# Altium schematic sheet Schematic.SchDoc
size A
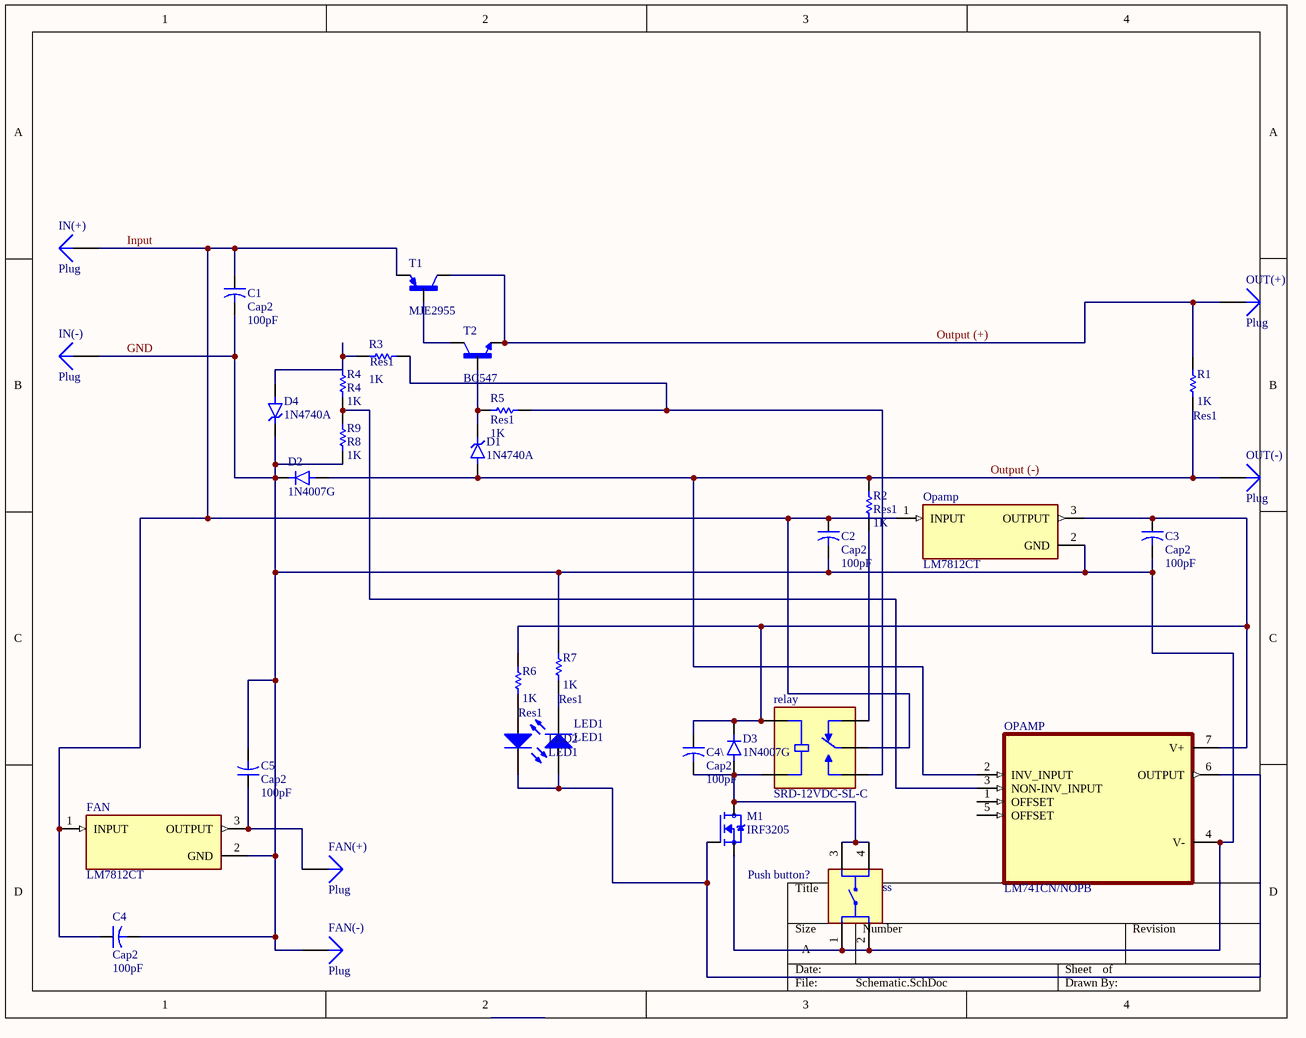
[diagram p0: Schematic.SchDoc]

## Parts
(Parts that share a designator on the sheet are numbered #1, #2 ... from top to bottom, then left to right.)
C1  Cap2  value 100pF  [CAPR5-4X5]
C2  Cap2  value 100pF  [CAPR5-4X5]
C3  Cap2  value 100pF  [CAPR5-4X5]
C4  Cap2  value 100pF  [CAPR5-4X5]
C4\  Cap2  value 100pF  [CAPR5-4X5]
C5  Cap2  value 100pF  [CAPR5-4X5]
D1  1N4740A  [DIOAD1060W70L435D230]
D2  1N4007G  [DIOAD1036W78L470D235]
D3  1N4007G  [DIOAD1036W78L470D235]
D4  1N4740A  [DIOAD1060W70L435D230]
FAN  LM7812CT  [TO253P1057X470X2040-3]
FAN(+)  Plug  [PIN1]
FAN(-)  Plug  [PIN1]
IN(+)  Plug  [PIN1]
IN(-)  Plug  [PIN1]
LED1  LED1  [LED-1]
LED2  LED1  [LED-1]
M1  IRF3205  [TO254P1041X444X2933-3]
Opamp#1  LM7812CT  [TO253P1057X470X2040-3]
OPAMP#2  LM741CN/NOPB  [DIP794W45P254L959H508Q8]
OUT(+)  Plug  [PIN1]
OUT(-)  Plug  [PIN1]
Push_button?  ss  [TE_1825910-2]
R1  Res1  value 1K  [AXIAL-0.3]
R2  Res1  value 1K  [AXIAL-0.3]
R3  Res1  value 1K  [AXIAL-0.3]
R4  R4  value 1K  [AXIAL-0.3]
R5  Res1  value 1K  [AXIAL-0.3]
R6  Res1  value 1K  [AXIAL-0.3]
R7  Res1  value 1K  [AXIAL-0.3]
R9  R8  value 1K  [AXIAL-0.3]
relay  SRD-12VDC-SL-C  [RELAY_SRD-12VDC-SL-C]
T1  MJE2955  [TO254P1010X470X2933-3]
T2  BC547  [TO92]

## Nets
GND: C1.2 C2.2 C3.2 C4.2 C5.2 D2.C(K) D4.C(K) FAN.2(GND) FAN(-).1 IN(-).1 M1.3(S) Opamp#1.2(GND) OPAMP#2.4(V-) Push_button?.1 Push_button?.2 R7.2 R9.2
Input: C1.1 C2.1 C4.1 FAN.1(INPUT) IN(+).1 Opamp#1.1(INPUT) relay.COM T1.3(E)
Output (+): OUT(+).1 R1.2 T1.2(C) T2.1(E)
Output (-): D1.A D2.A OPAMP#2.2(INV_INPUT) OUT(-).1 R1.1 R2.2
NetC3_1: C3.1 C4\.1 D3.C(K) Opamp#1.3(OUTPUT) OPAMP#2.7(V+) R6.2 relay.COIL1
NetC~{4}_2: C4\.2 D3.A M1.2(D) Push_button?.3 Push_button?.4 relay.COIL2
NetC5_1: C5.1 FAN.3(OUTPUT) FAN(+).1
NetD1_C: D1.C(K) R5.2 T2.2(B)
NetD4_A: D4.A R3.2 R4.1
NetLED1_1: LED1.1(A) LED2.2(K) M1.1(G) OPAMP#2.6(OUTPUT)
NetLED1_2: LED1.2(K) R7.1
NetLED2_1: LED2.1(A) R6.1
NetOPAMP#2_3: OPAMP#2.3(NON-INV_INPUT) R4.2 R9.1
NetR2_1: R2.1 relay.NC
NetR3_1: R3.1 R5.1 relay.NO
NetT1_1: T1.1(B) T2.3(C)

Not connected (* = marked no-connect by the designer): OPAMP#2 1(OFFSET) 5(OFFSET)

## Library data of the parts
C1-C4 C4\ C5 = Cap2: Capacitor; Published: 23-Sep-2002; PackageReference: CAPR5-4X5; Publisher: Altium Limited; PackageDescription: Capacitor; 2 Leads
D1 D4 = 1N4740A: DO-204AL (DO-41), 1000mW, 5%, Zener Diode; MF: Taiwan Semiconductor; Check_prices: https://www.snapeda.com/parts/1N4740A/Taiwan+Semiconductor/view-part/?ref=eda; Value: *; Availability: In Stock; MP: 1N4740A; Price: None; Package: DO-41 Taiwan Semiconductor; SnapEDA_Link: https://www.snapeda.com/parts/1N4740A/Taiwan+Semiconductor/view-part/?ref=snap
D2 D3 = 1N4007G: 1A, 1000V, Standard Recovery Rectifier; MF: Taiwan Semiconductor; Check_prices: https://www.snapeda.com/parts/1N4007G/Taiwan+Semiconductor/view-part/?ref=eda; Value: *; Availability: In Stock; MP: 1N4007G; Price: None; Package: DO-41 Taiwan Semiconductor; SnapEDA_Link: https://www.snapeda.com/parts/1N4007G/Taiwan+Semiconductor/view-part/?ref=snap; Purchase-URL: https://pricing.snapeda.com/search/part/1N4007G/?ref=eda
FAN Opamp#1 = LM7812CT: Linear Voltage Regulator IC Positive Fixed 1 Output  1A TO-220-3; MF: ON Semiconductor; Package: TO-220; MP: LM7812CT; Check_prices: https://www.snapeda.com/parts/LM7812CT/Onsemi/view-part/?ref=eda; Value: *; Price: None; Availability: Unavailable; SnapEDA_Link: https://www.snapeda.com/parts/LM7812CT/Onsemi/view-part/?ref=snap
LED1 LED2 = LED1: Typical RED GaAs LED; Published: 8-Jun-2000; LatestRevisionDate: 08-Jul-2005; LatestRevisionNote: Mech Layer 1 removed.; PackageReference: LED-1; Publisher: Altium Limited; PackageDescription: LED; 2 Leads
M1 = IRF3205: N-Channel 55V 110A (Tc) 200W (Tc) Through Hole TO-220AB; MF: Infineon Technologies; Price: None; Value: *; Purchase-URL: https://pricing.snapeda.com/search/part/IRF3205/?ref=eda; Package: TO-220 Infineon; Availability: In Stock; MP: IRF3205; SnapEDA_Link: https://www.snapeda.com/parts/IRF3205/Infineon+Technologies/view-part/?ref=snap; Check_prices: https://www.snapeda.com/parts/IRF3205/Infineon+Technologies/view-part/?ref=eda
OPAMP#2 = LM741CN/NOPB: Single 44V 1MHz operational amplifier 8-PDIP 0 to 70; MF: Texas Instruments; SnapEDA_Link: https://www.snapeda.com/parts/LM741CN/NOPB/Texas%20Instruments/view-part/74633/?ref=snap; Availability: Unavailable; MP: LM741CN/NOPB; DigiKey-Purchase-URL: https://snapeda.com/shop?store=DigiKey&id=74633; Price: None; Value: *; Texas_Instruments-Purchase-URL: https://snapeda.com/shop?store=Texas+Instruments&id=74633; Mouser-Purchase-URL: https://snapeda.com/shop?store=Mouser&id=74633; Package: PDIP-8 Texas Instruments
Push_button? = 1825910-2: 50 mA SPST Round Actuator 160 Gram Force Tactile Pushbutton Switch; MF: TE Connectivity; Check_prices: https://www.snapeda.com/parts/1825910-2/TE+Connectivity+ALCOSWITCH+Switches/view-part/?ref=eda; Value: *; Availability: In Stock; MP: 1825910-2; Price: None; Package: None; SnapEDA_Link: https://www.snapeda.com/parts/1825910-2/TE+Connectivity+ALCOSWITCH+Switches/view-part/?ref=snap; Purchase-URL: https://pricing.snapeda.com/search/part/1825910-2/?ref=eda; EU_RoHS_Compliance: Compliant
R1-R7 R9 = Res1: Resistor; Published: 8-Jun-2000; LatestRevisionDate: 17-Jul-2002; LatestRevisionNote: Re-released for DXP Platform.; PackageReference: AXIAL-0.3; Publisher: Altium Limited; PackageDescription: Axial Device, Thru-Hole; 2 Leads; 0.3 in Pin Spacing
relay = SRD-12VDC-SL-C: General Purpose Non Latching 12VDC SPDT Through Hole Relays RoHS; Price: None; Package: None; Availability: Unavailable; MP: SRD-12VDC-SL-C; Value: *
T1 = MJE2955: TRANS PNP 60V 10A TO220AB; MF: ON Semiconductor; Price: None; Value: *; Package: TO-220 ON Semiconductor; Availability: Unavailable; SnapEDA_Link: https://www.snapeda.com/parts/MJE2955/ON%20Semiconductor/view-part/581579/?ref=snap; MP: MJE2955
T2 = BC547: Trans GP BJT NPN 45V 0.1A 500mW 3-Pin TO-92 T/R; MF: ON Semiconductor; Package: None; MP: BC547; Check_prices: https://www.snapeda.com/parts/BC547/Onsemi/view-part/?ref=eda; Value: *; SnapEDA_Link: https://www.snapeda.com/parts/BC547/Onsemi/view-part/?ref=snap; Availability: In Stock; Price: None; Purchase-URL: https://pricing.snapeda.com/search/part/BC547/?ref=eda
FAN(+) FAN(-) IN(+) IN(-) OUT(+) OUT(-) = Plug: LatestRevisionDate: 17-Jul-2002; LatestRevisionNote: Re-released for DXP Platform.; Publisher: Altium Limited